# EAGLE design LM13700_v2 (EAGLE 9.5.2)
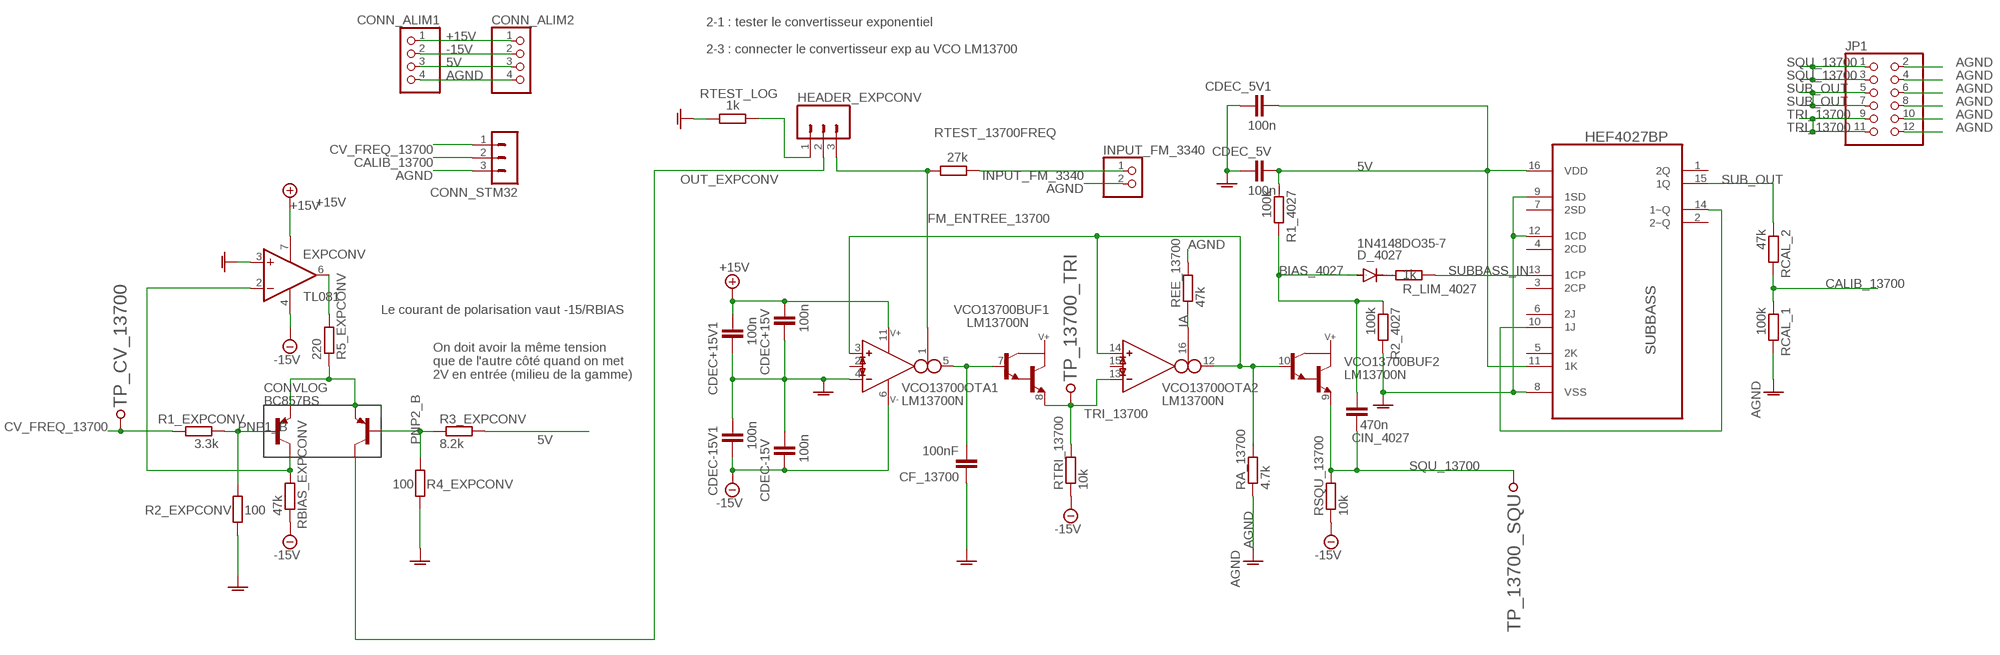
[diagram p0: schematic, sheet 1]

## Parts
CDEC+15V  100n  C-EU075-032X103  [C075-032X103]
CDEC+15V1  100n  C-EU050-025X075  [C050-025X075]
CDEC-15V  100n  C-EU050-025X075  [C050-025X075]
CDEC-15V1  100n  C-EU075-032X103  [C075-032X103]
CDEC_5V  100n  C-EU050-025X075  [C050-025X075]
CDEC_5V1  100n  C-EU050-025X075  [C050-025X075]
CF_13700  100nF  C-EU050-025X075  [C050-025X075]
CIN_4027  470n  C-EU050-025X075  [C050-025X075]
CONN_ALIM1  PINHD-1X4  [1X04]
CONN_ALIM2  PINHD-1X4  [1X04]
CONN_STM32  MA03-1  [MA03-1]
CONVLOG  BC857BS  [DIL06]
D_4027  1N4148DO35-7  [DO35-7]
EXPCONV  TL081  1AMP_P7+4N  [DIL08]
HEADER_EXPCONV  M03  [03P]
INPUT_FM_3340  PINHD-1X2  [1X02]
JP1  PINHD-2X6  [2X06]
R1_4027  100k  R-EU_0204/7  [0204/7]
R1_EXPCONV  3.3k  R-EU_0204/7  [0204/7]
R2_4027  100k  R-EU_0204/7  [0204/7]
R2_EXPCONV  100  R-EU_0204/7  [0204/7]
R3_EXPCONV  8.2k  R-EU_0204/7  [0204/7]
R4_EXPCONV  100  R-EU_0204/7  [0204/7]
R5_EXPCONV  220  R-EU_0204/7  [0204/7]
R_LIM_4027  1k  R-EU_0204/7  [0204/7]
RA_13700  4.7k  R-EU_0204/7  [0204/7]
RBIAS_EXPCONV  47k  R-EU_0204/7  [0204/7]
RCAL_1  100k  R-EU_0204/7  [0204/7]
RCAL_2  47k  R-EU_0204/7  [0204/7]
REE_13700  47k  R-EU_0204/7  [0204/7]
RSQU_13700  10k  R-EU_0204/7  [0204/7]
RTEST_13700FREQ  27k  R-EU_0204/7  [0204/7]
RTEST_LOG  1k  R-EU_0204/7  [0204/7]
RTRI_13700  10k  R-EU_0204/7  [0204/7]
SUBBASS  HEF4027BP  [DIP254P762X420-16]
TP_13700_SQU  TESTPOINT  [TESTPOINT_63]
TP_13700_TRI  TESTPOINT  [TESTPOINT_63]
TP_CV_13700  TESTPOINT  [TESTPOINT_63]
VCO13700  LM13700N  [DIL16]

## Nets
5V: CDEC_5V1.1 CDEC_5V.1 CONN_ALIM1.3 CONN_ALIM2.3 R1_4027.1 R3_EXPCONV.2 SUBBASS.11(1K) SUBBASS.16(VDD)
+15V: CDEC+15V1.1 CDEC+15V.1 CONN_ALIM1.1 CONN_ALIM2.1 EXPCONV.7(V+) VCO13700.11(SUPPLY:V+)
-15V: CDEC-15V1.2 CDEC-15V.2 CONN_ALIM1.2 CONN_ALIM2.2 EXPCONV.4(V-) RBIAS_EXPCONV.1 RSQU_13700.1 RTRI_13700.1 VCO13700.6(SUPPLY:V-)
AGND: CDEC+15V1.2 CDEC+15V.2 CDEC-15V1.1 CDEC-15V.1 CDEC_5V1.2 CDEC_5V.2 CF_13700.1 CONN_ALIM1.4 CONN_ALIM2.4 CONN_STM32.3 EXPCONV.3(+IN) INPUT_FM_3340.2 JP1.2 JP1.4 JP1.6 JP1.8 JP1.10 JP1.12 R2_4027.2 R2_EXPCONV.2 R4_EXPCONV.2 RA_13700.1 RCAL_1.2 REE_13700.2 RTEST_LOG.2 SUBBASS.8(VSS) SUBBASS.9(1SD) SUBBASS.12(1CD) VCO13700.4(OTA1:IN_N)
BIAS_4027: CIN_4027.1 D_4027.A R1_4027.2 R2_4027.1
CALIB_13700: CONN_STM32.2 RCAL_1.1 RCAL_2.2
CV_FREQ_13700: CONN_STM32.1 R1_EXPCONV.2 TP_CV_13700.P$1
FM_ENTREE_13700: HEADER_EXPCONV.3 RTEST_13700FREQ.2 VCO13700.1(OTA1:I_BIAS)
IA: REE_13700.1 VCO13700.16(OTA2:I_BIAS)
INPUT_FM_3340: INPUT_FM_3340.1 RTEST_13700FREQ.1
N$3: SUBBASS.10(1J) SUBBASS.14(1~Q)
N$47: D_4027.C R_LIM_4027.2
N$52: EXPCONV.6(OUT) R5_EXPCONV.2
N$63: RA_13700.2 VCO13700.3(OTA1:IN_P) VCO13700.10(BUF2:B) VCO13700.12(OTA2:OUT) VCO13700.14(OTA2:IN_P)
N$64: CF_13700.2 VCO13700.5(OTA1:OUT) VCO13700.7(BUF1:B)
N$94: HEADER_EXPCONV.1 RTEST_LOG.1
OUT_EXPCONV: CONVLOG.3(C2) HEADER_EXPCONV.2
PNP1_B: CONVLOG.2(B1) R1_EXPCONV.1 R2_EXPCONV.1
PNP1_C: CONVLOG.6(C1) EXPCONV.2(-IN) RBIAS_EXPCONV.2
PNP2_B: CONVLOG.5(B2) R3_EXPCONV.1 R4_EXPCONV.1
PNP_E: CONVLOG.1(E1) CONVLOG.4(E2) R5_EXPCONV.1
SQU_13700: CIN_4027.2 JP1.1 JP1.3 RSQU_13700.2 TP_13700_SQU.P$1 VCO13700.9(BUF2:E)
SUB_OUT: JP1.5 JP1.7 RCAL_2.1 SUBBASS.15(1Q)
SUBBASS_IN: R_LIM_4027.1 SUBBASS.13(1CP)
TRI_13700: JP1.9 JP1.11 RTRI_13700.2 TP_13700_TRI.P$1 VCO13700.8(BUF1:E) VCO13700.13(OTA2:IN_N)
Unconnected: SUBBASS.1(2Q) SUBBASS.2(2~Q) SUBBASS.3(2CP) SUBBASS.4(2CD) SUBBASS.5(2K) SUBBASS.6(2J) SUBBASS.7(2SD) VCO13700.2(OTA1:I_DIODE) VCO13700.15(OTA2:I_DIODE)

## Notes on the sheet
- 2-1 : tester le convertisseur exponentiel
  
  2-3 : connecter le convertisseur exp au VCO LM13700
- Le courant de polarisation vaut -15/RBIAS
- On doit avoir la même tension 
  que de l'autre côté quand on met
  2V en entrée (milieu de la gamme)

## Library data of the parts
CDEC+15V CDEC+15V1 CDEC-15V CDEC-15V1 CDEC_5V CDEC_5V1 CF_13700 CIN_4027 = rcl:C-EU: CAPACITOR, European symbol; SPICEPREFIX: C
CONN_ALIM1 CONN_ALIM2 = pinhead:PINHD-1X4: PIN HEADER
CONN_STM32 = con-lstb:MA03-1: PIN HEADER; OC_FARNELL: unknown; OC_NEWARK: unknown
CONVLOG = paires_diff:BC857BS
D_4027 = diode:1N4148: DIODE high speed (Philips)
EXPCONV = linear:1AMP_P7+4: OP AMP
HEADER_EXPCONV = con-amp-quick:M03: AMP QUICK CONNECTOR; OC_FARNELL: unknown; OC_NEWARK: unknown
INPUT_FM_3340 = pinhead:PINHD-1X2: PIN HEADER
JP1 = pinhead:PINHD-2X6: PIN HEADER
R1_4027 R1_EXPCONV R2_4027 R2_EXPCONV R3_EXPCONV R4_EXPCONV R5_EXPCONV R_LIM_4027 RA_13700 RBIAS_EXPCONV RCAL_1 RCAL_2 REE_13700 RSQU_13700 RTEST_13700FREQ RTEST_LOG RTRI_13700 = rcl:R-EU_: RESISTOR, European symbol; SPICEPREFIX: R
SUBBASS = HEF4027BP:HEF4027BP: Dual JK flip-flop; AVAILABILITY: Unavailable; DESCRIPTION: Dual J-K flip-flop w/set&reset HEF4027BP; MF: NXP Semiconductors; MP: HEF4027BP; PACKAGE: DIP-16 NXP Semiconductors; PRICE: None
TP_13700_SQU TP_13700_TRI TP_CV_13700 = 6P1_EVB:TESTPOINT
VCO13700 = ota:LM13700: Dual OTA with buffers

## Board
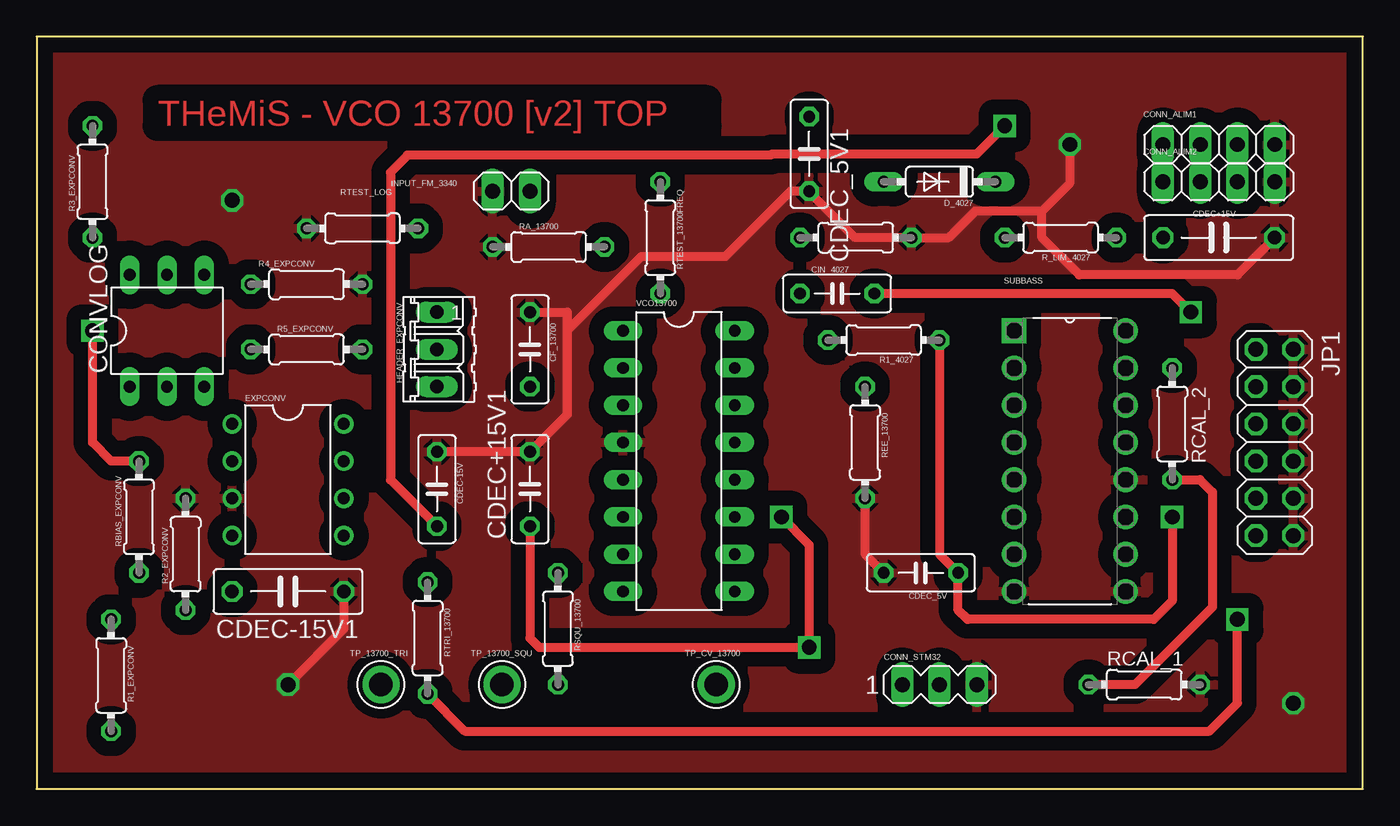
[diagram p1: board, top side]
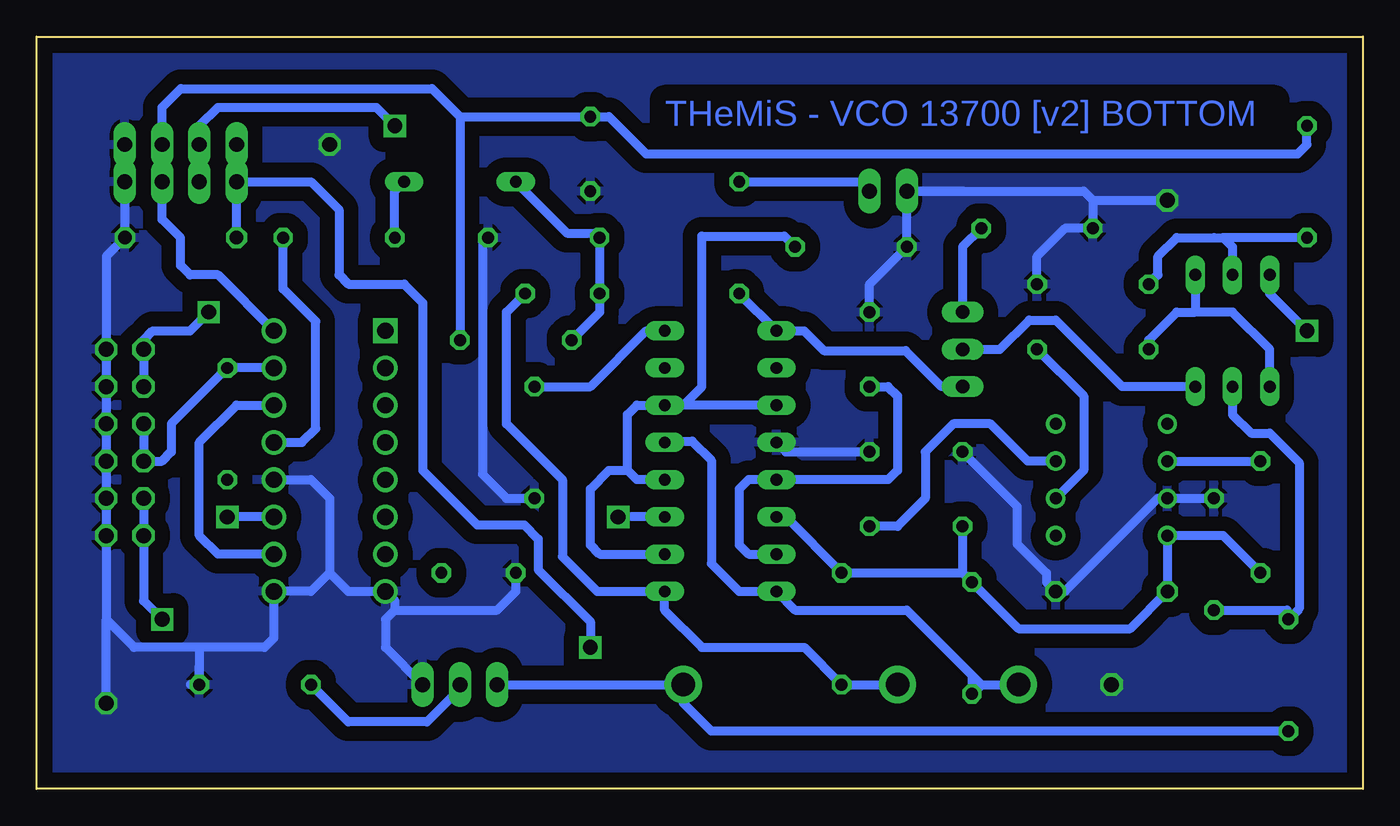
[diagram p2: board, bottom side, seen from below]

Size 90.47 x 51.3 mm. Coordinates in mm from the lower left corner, seen from the top.
Outline: 0,0 90.47,0 90.47,51.3 0,51.3 0,0
Copper layers (1*16): Top 0.035mm / dielectric 1.5mm / Bottom 0.035mm
Design rules "default *": minimum track width 0.4mm, minimum drill 0.35mm, track to track 0.4mm, track to pad 0.4mm, pad to pad 0.4mm, via to via 0.4mm, smd to smd 0.4mm, copper to edge 40mil, drill to drill 6mil, minimum pad ring 10mil, minimum via ring 8mil, stop-mask expansion 4mil, vias tented up to drill 0mil, thermal gap 10mil

### Footprints (pad centres in the part's own frame; a part is rotated, then mirrored left to right if it is on the bottom)
C075-032X103 = drill 0.914 octagon: 1 -3.81,0; 2 3.81,0
C050-025X075 = drill 0.813 octagon: 1 -2.54,0; 2 2.54,0
1X04 = drill 1.016 long: 1 -3.81,0; 2 -1.27,0; 3 1.27,0; 4 3.81,0
MA03-1 = drill 1.016 long: 1 -2.54,0; 2 0,0; 3 2.54,0
DIL06 = drill 0.813 long: 1 -2.54,-3.81; 2 0,-3.81; 3 2.54,-3.81; 4 2.54,3.81; 5 0,3.81; 6 -2.54,3.81
DO35-7 = drill 0.813 long: A 3.81,0; C -3.81,0
DIL08 = drill 0.813 pad 1.27: 1 -3.81,-3.81; 2 -1.27,-3.81; 3 1.27,-3.81; 4 3.81,-3.81; 5 3.81,3.81; 6 1.27,3.81; 7 -1.27,3.81; 8 -3.81,3.81
03P = drill 0.914 long: 1 -2.54,0; 2 0,0; 3 2.54,0
1X02 = drill 1.016 long: 1 -1.27,0; 2 1.27,0
2X06 = drill 1.016 octagon: 1 -6.35,-1.27; 2 -6.35,1.27; 3 -3.81,-1.27; 4 -3.81,1.27; 5 -1.27,-1.27; 6 -1.27,1.27; 7 1.27,-1.27; 8 1.27,1.27; 9 3.81,-1.27; 10 3.81,1.27; 11 6.35,-1.27; 12 6.35,1.27
0204/7 = drill 0.813 octagon: 1 -3.81,0; 2 3.81,0
DIP254P762X420-16 = drill 1.118 square: 1 -7.62,17.78 | drill 1.118: 2 -7.62,15.24; 3 -7.62,12.7; 4 -7.62,10.16; 5 -7.62,7.62; 6 -7.62,5.08; 7 -7.62,2.54; 8 -7.62,0; 9 0,0; 10 0,2.54; 11 0,5.08; 12 0,7.62; 13 0,10.16; 14 0,12.7; 15 0,15.24; 16 0,17.78
TESTPOINT_63 = drill 1.6 pad 2.54: P$1 0,0
DIL16 = drill 0.813 long: 1 -8.89,-3.81; 2 -6.35,-3.81; 3 -3.81,-3.81; 4 -1.27,-3.81; 5 1.27,-3.81; 6 3.81,-3.81; 7 6.35,-3.81; 8 8.89,-3.81; 9 8.89,3.81; 10 6.35,3.81; 11 3.81,3.81; 12 1.27,3.81; 13 -1.27,3.81; 14 -3.81,3.81; 15 -6.35,3.81; 16 -8.89,3.81

### Placement (x,y rotation side)
CDEC+15V  80.64,37.59 0 top
CDEC+15V1  33.66,20.45 90 top
CDEC-15V  27.3,20.45 270 top
CDEC-15V1  17.14,13.46 180 top
CDEC_5V  60.33,14.73 180 top
CDEC_5V1  52.7,43.31 270 top
CF_13700  33.66,29.97 270 top
CIN_4027  54.61,33.78 0 top
CONN_ALIM1  80.64,43.94 0 top
CONN_ALIM2  80.64,41.4 0 top
CONN_STM32  61.59,7.11 0 top
CONVLOG  8.89,31.24 0 top
D_4027  61.59,41.4 180 top
EXPCONV  17.14,21.08 270 top
HEADER_EXPCONV  27.3,29.97 270 top
INPUT_FM_3340  32.38,40.77 180 top
JP1  84.45,23.62 270 top
R1_4027  57.79,30.61 180 top
R1_EXPCONV  5.08,7.75 270 top
R2_4027  55.88,37.59 0 top
R2_EXPCONV  10.16,16 90 top
R3_EXPCONV  3.81,41.4 90 top
R4_EXPCONV  18.42,34.42 0 top
R5_EXPCONV  18.42,29.97 0 top
R_LIM_4027  69.85,37.59 180 top
RA_13700  34.93,36.96 0 top
RBIAS_EXPCONV  6.99,18.54 90 top
RCAL_1  75.56,7.11 0 top
RCAL_2  77.47,24.89 270 top
REE_13700  56.52,23.62 270 top
RSQU_13700  35.56,10.92 270 top
RTEST_13700FREQ  42.55,37.59 270 top
RTEST_LOG  22.23,38.23 180 top
RTRI_13700  26.67,10.29 270 top
SUBBASS  74.3,13.46 0 top
TP_13700_SQU  31.75,7.11 0 top
TP_13700_TRI  23.5,7.11 0 top
TP_CV_13700  46.36,7.11 0 top
VCO13700  43.81,22.35 270 top

### Tracks (layer width: path | path; a pad name or v marks a point on that pad's centre or on a via)
5V  (via drill 1.02)
  Top 0.61: v77.47,18.54 77.47,12.83 76.2,11.56 63.5,11.56 62.87,12.19 CDEC_5V.1 61.59,16 R1_4027.1
  Bottom 0.61: 61.59,45.85 R1_4027.1 | 61.59,45.85 CDEC_5V1.1 51.44,45.85 48.9,43.31 4.45,43.31 3.81,43.94 R3_EXPCONV.2 | 61.59,45.85 63.5,47.75 80.64,47.75 81.92,46.48 CONN_ALIM1.3 CONN_ALIM2.3 81.92,38.84 80.66,37.58 80.66,35.7 80.01,35.05 78.11,35.05 SUBBASS.16 | SUBBASS.11 v77.47,18.54
+15V  (via drill 1.02)
  Top 0.61: v50.8,18.54 52.7,16.64 v52.7,9.65 34.29,9.65 33.66,10.29 CDEC+15V1.1
  Bottom 0.61: CONN_ALIM2.1 71.75,41.4 69.85,39.5 69.85,35.05 69.22,34.42 65.41,34.42 64.13,33.15 64.13,21.72 60.42,18 57.22,18 56.26,17.04 56.26,14.95 52.7,11.4 v52.7,9.65 | CONN_ALIM1.1 CONN_ALIM2.1 | CDEC+15V.1 CONN_ALIM2.1 | EXPCONV.7 22.86,22.35 25.4,24.89 27.94,24.89 29.85,22.99 29.85,19.81 31.75,17.91 CDEC+15V1.1 | VCO13700.11 v50.8,18.54
-15V  (via drill 1.02)
  Top 0.61: v66.04,45.21 64.13,43.31 50.16,43.31 50.07,43.21 25.3,43.21 24.14,42.05 24.14,21.07 CDEC-15V.2
  Bottom 0.61: CONN_ALIM2.2 CONN_ALIM1.2 79.38,45.21 78.11,46.48 67.31,46.48 v66.04,45.21 | CDEC-15V.2 27.3,14.73 | 27.3,14.73 RTRI_13700.1 23.5,10.92 15.88,10.92 CDEC-15V1.2 EXPCONV.4 9.53,17.27 RBIAS_EXPCONV.1 | VCO13700.6 39.37,18.54 RSQU_13700.1 27.3,14.73
AGND  (via drill 1.02)
  Top 0.61: CDEC+15V1.2 CDEC-15V.1 | 36.2,31.24 41.27,36.32 46.99,36.32 51.44,40.77 CDEC_5V1.2 52.7,40.72 55.83,37.59 R2_4027.2 | CF_13700.1 36.2,32.51 36.2,31.24 | 68.58,39.4 64.04,39.4 62.23,37.59 R2_4027.2 | 36.2,31.24 36.2,25.53 CDEC+15V1.2 | REE_13700.2 56.52,16 CDEC_5V.2 | 35.56,24.89 CDEC+15V1.2 | R2_4027.2 59.03,37.59 | v70.48,43.94 70.48,41.31 68.58,39.4 | CDEC-15V1.1 20.96,10.92 v17.14,7.11 | CDEC+15V.2 81.92,35.05 71.12,35.05 68.58,37.59 68.58,39.4
  Bottom 0.61: CONN_ALIM1.4 CONN_ALIM2.4 CDEC+15V.2 85.72,36.32 JP1.2 JP1.4 JP1.6 JP1.8 JP1.10 JP1.12 85.72,11.56 | INPUT_FM_3340.2 RA_13700.1 33.66,34.42 CF_13700.1 | 85.72,11.56 83.82,9.65 79.38,9.65 | 79.38,9.65 74.93,9.65 74.3,10.29 SUBBASS.9 71.75,13.46 70.48,14.73 | INPUT_FM_3340.2 19.05,40.77 18.42,40.13 | 18.42,40.13 RTEST_LOG.2 20.32,38.23 22.23,36.32 R4_EXPCONV.2 | R2_EXPCONV.2 EXPCONV.3 13.97,19.81 20.32,13.46 CDEC-15V1.1 21.59,14.1 21.59,14.71 23.59,16.71 23.59,19.27 CDEC-15V.1 25.75,21.43 | VCO13700.4 39.37,22.99 CDEC+15V1.2 | SUBBASS.12 71.75,21.08 70.48,19.81 70.48,14.73 | R2_4027.2 59.85,37.59 60.06,37.38 60.06,21.46 58.42,19.81 REE_13700.2 | 79.38,9.65 RCAL_1.2 | 27.28,40.77 INPUT_FM_3340.2 | CONN_STM32.3 66.67,9.65 66.67,11.56 66.04,12.19 | RCAL_1.2 79.99,7.11 | RCAL_1.2 79.38,8.38 | 18.42,40.13 v13.33,40.13 | v85.72,5.84 85.72,11.56 | 70.48,14.73 69.22,13.46 SUBBASS.8 66.04,12.83 66.04,12.19 | 66.04,12.19 59.05,12.19 57.79,13.46 CDEC_5V.2
  pour Top (isolate 1.016): 0.64,50.93 90.17,50.93 90.81,50.29 90.81,1.4 0.64,1.4
  pour Bottom (isolate 1.016): 0.64,50.93 90.17,50.93 90.81,50.29 90.81,1.4 0.64,1.4
BIAS_4027
  Bottom 0.61: R1_4027.2 52.07,32.51 CIN_4027.1 R2_4027.1 52.38,37.9 54.3,37.9 57.79,41.38 D_4027.A
CALIB_13700
  Top 0.61: RCAL_2.2 79.36,21.08 80.21,20.23 80.21,12.39 74.93,7.11 RCAL_1.1
  Bottom 0.61: CONN_STM32.2 61.59,6.82 63.84,4.57 69.22,4.57 RCAL_1.1
CV_FREQ_13700
  Bottom 0.61: CONN_STM32.1 TP_CV_13700.P$1 46.36,5.84 44.45,3.94 R1_EXPCONV.2
FM_ENTREE_13700
  Bottom 0.61: RTEST_13700FREQ.2 VCO13700.1 38.13,31.24 36.77,29.89 31.2,29.89 28.75,27.43 HEADER_EXPCONV.3
IA
  Bottom 0.61: VCO13700.16 48.9,31.24 52.7,27.43 REE_13700.1
INPUT_FM_3340
  Bottom 0.61: RTEST_13700FREQ.1 34.29,41.4 INPUT_FM_3340.1
N$3
  Bottom 0.61: SUBBASS.10 78.11,16 79.38,17.27 79.38,23.62 76.84,26.16 SUBBASS.14
N$47
  Bottom 0.61: R_LIM_4027.2 66.04,40.77 D_4027.C
N$52
  Bottom 0.61: R5_EXPCONV.2 19.05,26.8 19.05,21.72 EXPCONV.6
N$63
  Bottom 0.61: VCO13700.12 49.53,21.08 50.16,21.72 | VCO13700.10 52.07,16 52.7,16.64 52.7,20.45 51.44,21.72 50.16,21.72 | VCO13700.3 46.36,26.16 | RA_13700.2 39.47,37.69 45.09,37.69 45.09,27.43 46.36,26.16 | 50.16,21.72 50.16,25.53 49.53,26.16 VCO13700.14 46.36,26.16
N$64
  Bottom 0.61: CF_13700.2 32.38,27.43 31.75,26.8 31.75,21.72 32.38,21.08 VCO13700.5 41.91,21.08 42.55,20.45 42.55,16.64 41.91,16 VCO13700.7
N$94
  Bottom 0.61: RTEST_LOG.1 27.3,36.96 HEADER_EXPCONV.1
OUT_EXPCONV
  Bottom 0.61: HEADER_EXPCONV.2 24.77,29.97 22.77,31.97 20.96,31.97 16.41,27.43 CONVLOG.3
PNP1_B
  Bottom 0.61: R2_EXPCONV.1 5.17,12.19 R1_EXPCONV.1 4.35,12.29 4.35,22.26 6.35,24.26 7.62,24.26 8.89,25.53 CONVLOG.2
PNP1_C  (via drill 1.02)
  Top 0.61: RBIAS_EXPCONV.2 5.08,22.35 3.81,23.62 v3.81,31.24
  Bottom 0.61: EXPCONV.2 RBIAS_EXPCONV.2 | CONVLOG.6 6.35,33.78 v3.81,31.24
PNP2_B
  Bottom 0.61: R4_EXPCONV.1 13.97,35.05 13.97,36.32 12.7,37.59 10.16,37.59 9.53,37.59 | 9.53,37.59 8.89,36.96 CONVLOG.5 | R3_EXPCONV.1 9.53,37.59
PNP_E
  Bottom 0.61: CONVLOG.4 11.43,32.51 | CONVLOG.1 6.35,29.97 8.89,32.51 11.43,32.51 | R5_EXPCONV.1 14.6,30.61 12.7,32.51 11.43,32.51
SQU_13700  (via drill 1)
  Top 0.61: v78.74,32.51 77.47,33.78 CIN_4027.2
  Bottom 0.61: TP_13700_SQU.P$1 RSQU_13700.2 38.1,9.65 45.09,9.65 47.62,12.19 VCO13700.9 52.23,13.46 54.61,15.84 54.61,21.08 58.42,24.89 58.42,32.51 CIN_4027.2 | JP1.3 JP1.1 83.19,30.61 82.55,31.24 80.01,31.24 v78.74,32.51
SUB_OUT
  Bottom 0.61: SUBBASS.15 RCAL_2.1 81.28,24.89 81.28,22.99 81.92,22.35 JP1.7 JP1.5
SUBBASS_IN
  Bottom 0.61: SUBBASS.13 72.39,23.62 71.44,24.57 71.44,31.88 73.66,34.1 R_LIM_4027.1
TRI_13700  (via drill 1.02)
  Top 0.61: RTRI_13700.2 29.21,3.94 80.01,3.94 81.92,5.84 v81.92,11.56
  Bottom 0.61: 26.04,7.11 RTRI_13700.2 26.67,7.75 | 26.04,7.11 TP_13700_TRI.P$1 | VCO13700.13 47.53,23.72 45.76,23.72 44.45,22.4 44.45,15.37 42.55,13.46 VCO13700.8 38.73,12.19 31.12,12.19 26.67,7.75 | 26.67,7.75 26.04,7.11 | v81.92,11.56 83.19,12.83 JP1.11 JP1.9

### Text on the board
Top: THeMiS - VCO 13700 [v2] TOP
Bottom: THeMiS - VCO 13700 [v2] BOTTOM